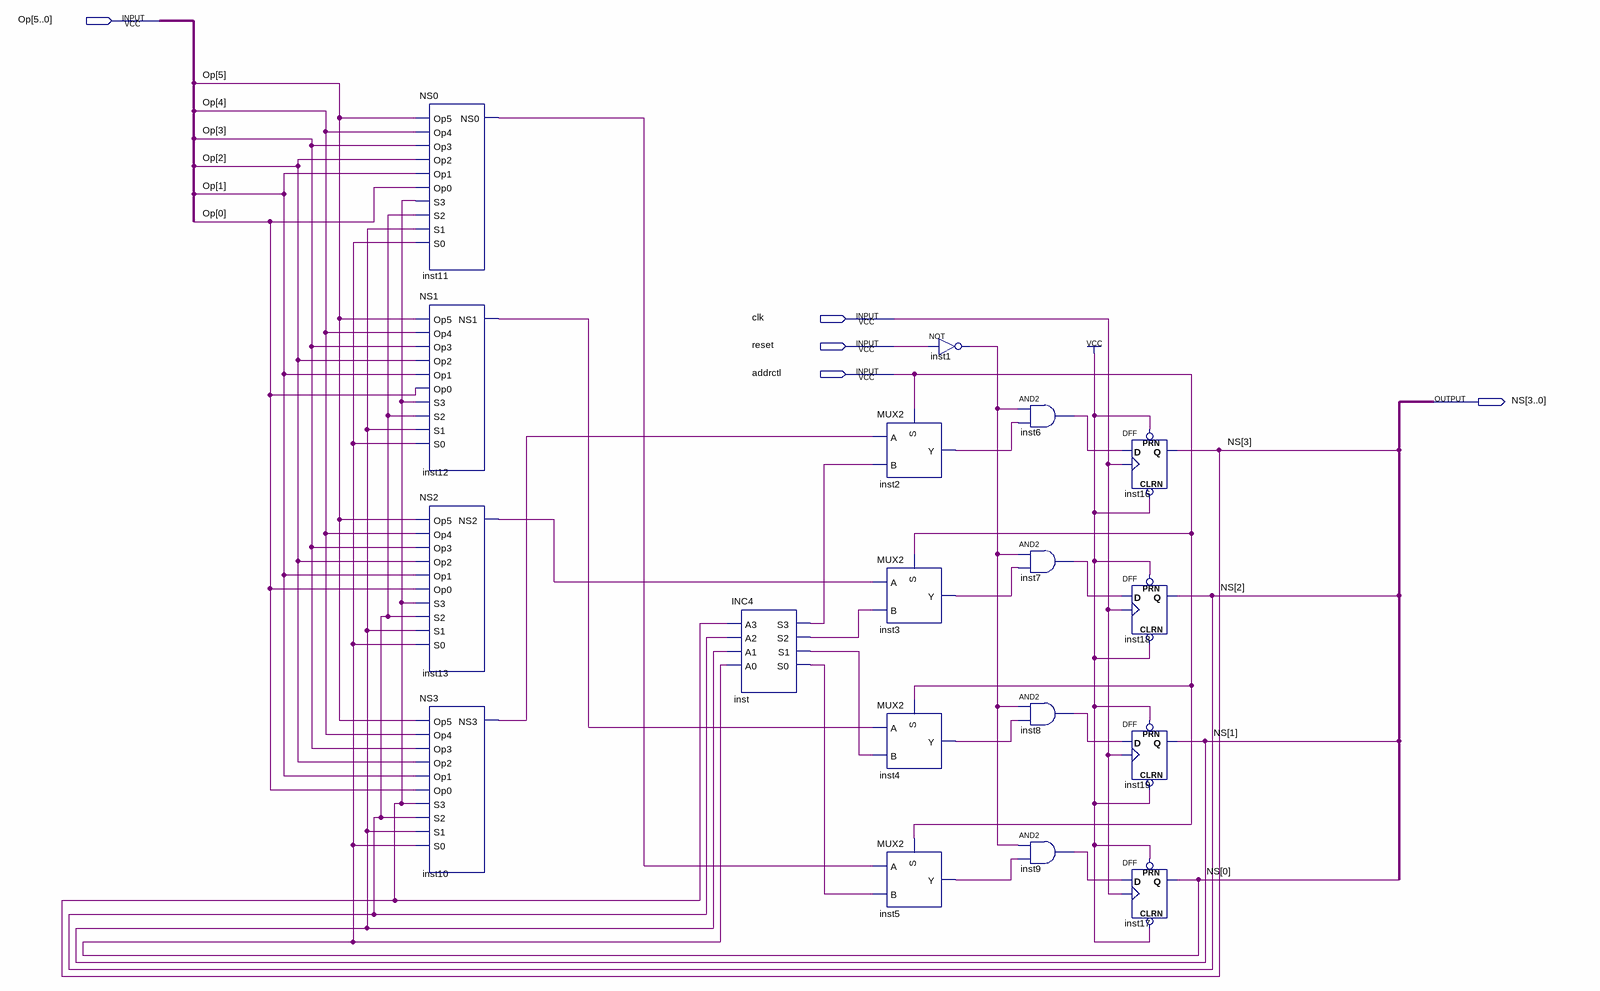
[diagram p0: schematic sheet]
// Quartus schematic FSM.bdf as structural Verilog: 18 symbols, 5 pins
module FSM (
  input  [5:0] Op,
  input  clk,
  input  reset,
  input  addrctl,
  output [3:0] NS
);

  wire inst1_out, inst2_y, inst3_y, inst4_y, inst5_y, inst6_out, inst7_out, inst8_out, inst9_out, inst10_ns3,
       inst11_ns0, inst12_ns1, inst13_ns2, inst_s0, inst_s1, inst_s2, inst_s3;

  NS0 inst11 (
    .Op5(Op[5]), .Op4(Op[4]), .Op3(Op[3]), .Op2(Op[2]), .Op1(Op[1]), .Op0(Op[0]), .S3(NS[3]), .S2(NS[2]),
    .S1(NS[1]), .S0(NS[0]), .NS0(inst11_ns0));
  NS1 inst12 (
    .Op5(Op[5]), .Op4(Op[4]), .Op3(Op[3]), .Op2(Op[2]), .Op1(Op[1]), .Op0(Op[0]), .S3(NS[3]), .S2(NS[2]),
    .S1(NS[1]), .S0(NS[0]), .NS1(inst12_ns1));
  NS2 inst13 (
    .Op5(Op[5]), .Op4(Op[4]), .Op3(Op[3]), .Op2(Op[2]), .Op1(Op[1]), .Op0(Op[0]), .S3(NS[3]), .S2(NS[2]),
    .S1(NS[1]), .S0(NS[0]), .NS2(inst13_ns2));
  NS3 inst10 (
    .Op5(Op[5]), .Op4(Op[4]), .Op3(Op[3]), .Op2(Op[2]), .Op1(Op[1]), .Op0(Op[0]), .S3(NS[3]), .S2(NS[2]),
    .S1(NS[1]), .S0(NS[0]), .NS3(inst10_ns3));
  INC4 inst (.A3(NS[3]), .A2(NS[2]), .A1(NS[1]), .A0(NS[0]), .S3(inst_s3), .S2(inst_s2), .S1(inst_s1), .S0(inst_s0));
  MUX2 inst2 (.S(addrctl), .A(inst10_ns3), .B(inst_s3), .Y(inst2_y));
  MUX2 inst3 (.S(addrctl), .A(inst13_ns2), .B(inst_s2), .Y(inst3_y));
  MUX2 inst4 (.S(addrctl), .A(inst12_ns1), .B(inst_s1), .Y(inst4_y));
  MUX2 inst5 (.S(addrctl), .A(inst11_ns0), .B(inst_s0), .Y(inst5_y));
  not inst1 (inst1_out, reset);
  and inst6 (inst6_out, inst1_out, inst2_y);
  and inst7 (inst7_out, inst1_out, inst3_y);
  and inst8 (inst8_out, inst1_out, inst4_y);
  and inst9 (inst9_out, inst1_out, inst5_y);
  DFF inst16 (.CLRN(1'b1), .CLK(clk), .D(inst6_out), .PRN(1'b1), .Q(NS[3]));
  DFF inst18 (.CLRN(1'b1), .CLK(clk), .D(inst7_out), .PRN(1'b1), .Q(NS[2]));
  DFF inst19 (.CLRN(1'b1), .CLK(clk), .D(inst8_out), .PRN(1'b1), .Q(NS[1]));
  DFF inst17 (.CLRN(1'b1), .CLK(clk), .D(inst9_out), .PRN(1'b1), .Q(NS[0]));
endmodule
